# EAGLE design kul_rev0 (EAGLE 9.6.2)
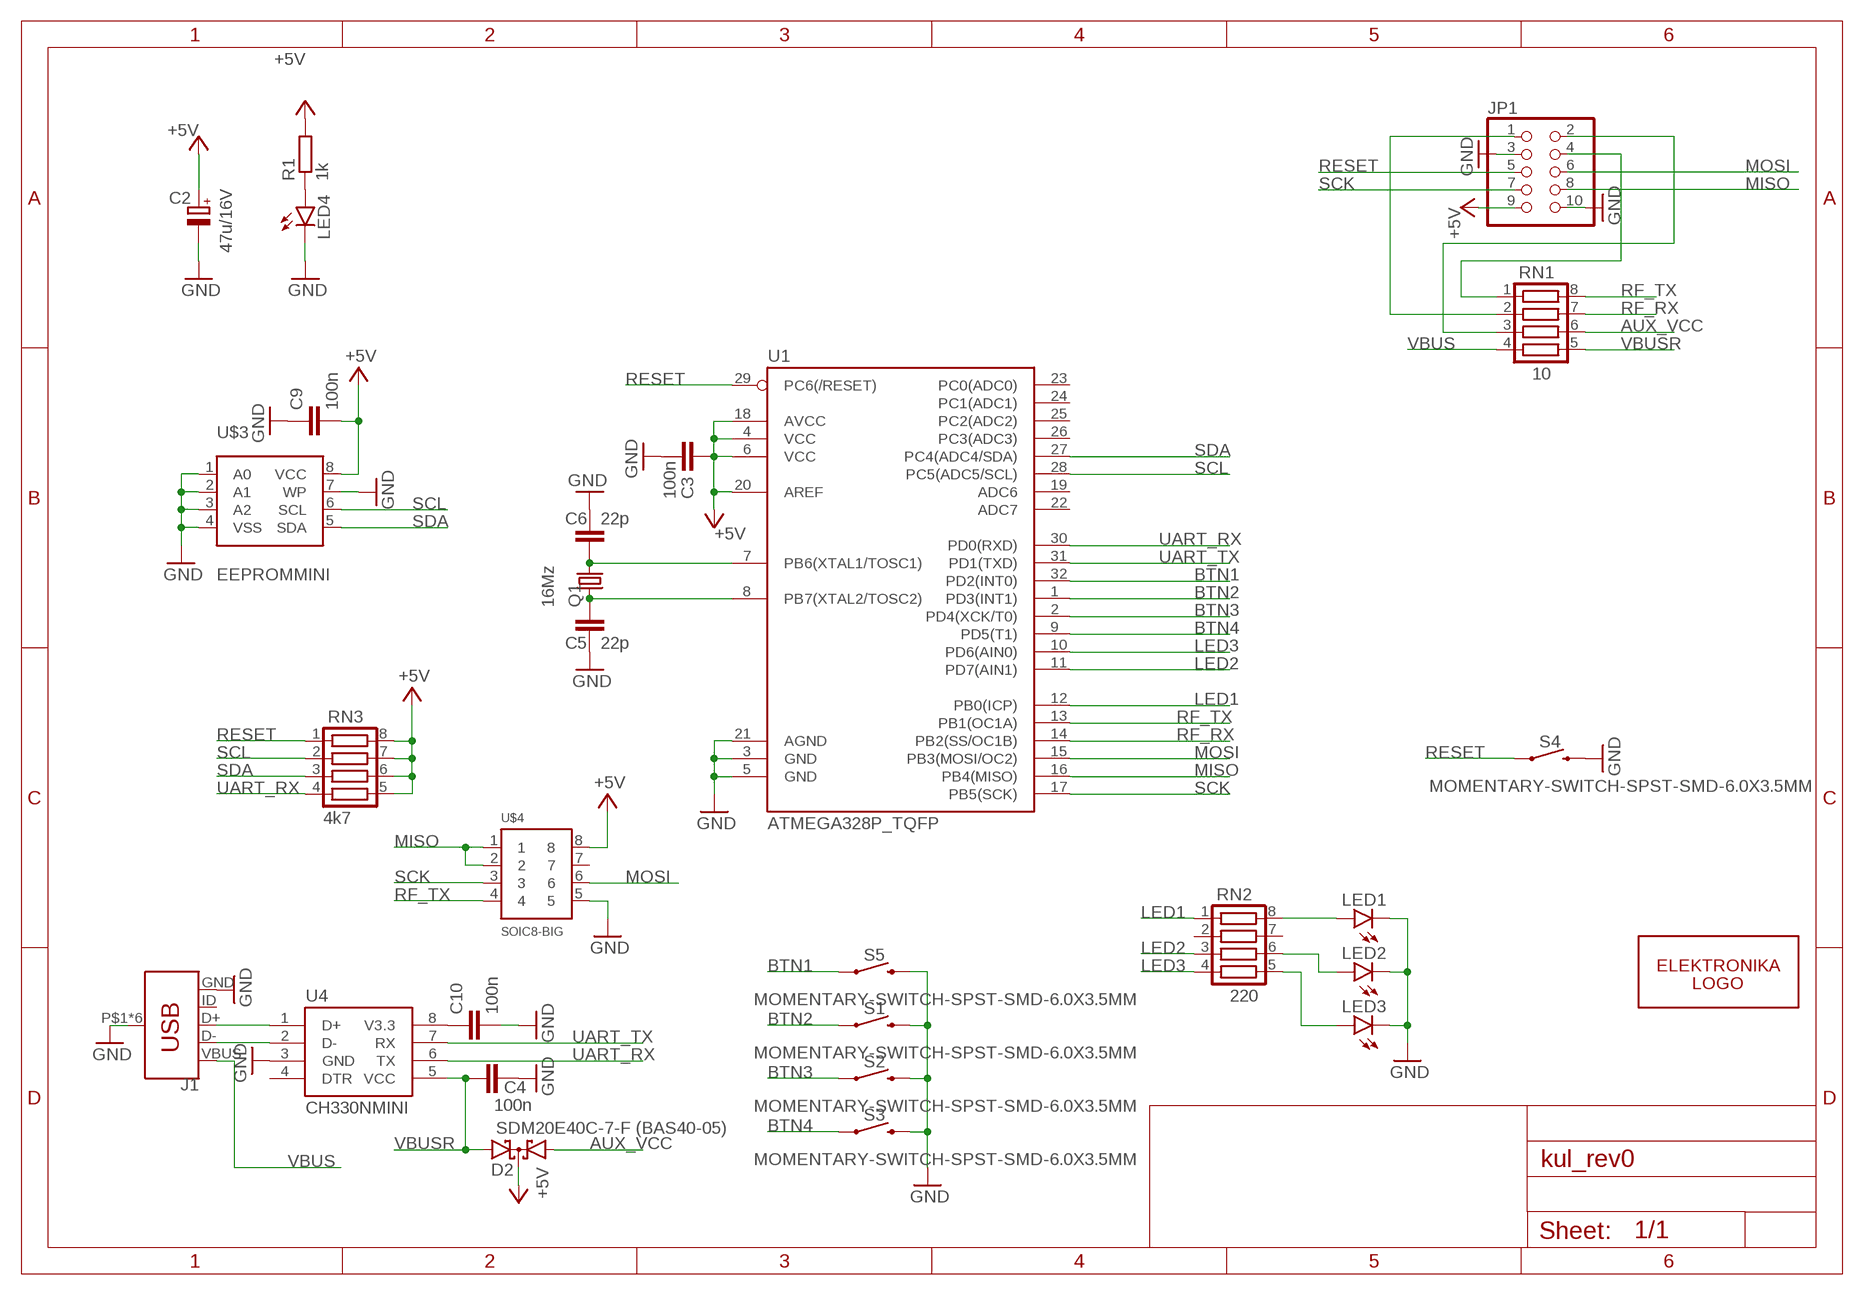
[diagram p0: schematic, sheet 1]

## Parts
C2  47u/16V  CPOL-EUCT6032  [CT6032]
C3  100n  C-EUC0603  [C0603]
C4  100n  C-EUC0603  [C0603]
C5  22p  C-EUC0603  [C0603]
C6  22p  C-EUC0603  [C0603]
C9  100n  C-EUC0603  [C0603]
C10  100n  C-EUC0603  [C0603]
D2  SDM20E40C-7-F (BAS40-05)  BAS40-05  [SOT23]
J1  USB_MICRO-BLCSC  [C40951_USB]
JP1  PINHD-2X5/90  [2X05/90]
LED1  LEDCHIP-LED0805  [CHIP-LED0805]
LED2  LEDCHIP-LED0805  [CHIP-LED0805]
LED3  LEDCHIP-LED0805  [CHIP-LED0805]
LED4  LEDCHIP-LED0805  [CHIP-LED0805]
Q1  16Mz  KX-7  [3.2X2.5_KX-7]
R1  1k  R-EU_R0603  [R0603]
RN1  10  CTS742C083  [CTS742C083]
RN2  220  CTS742C083  [CTS742C083]
RN3  4k7  CTS742C083  [CTS742C083]
S1  MOMENTARY-SWITCH-SPST-SMD-6.0X3.5MM  [TACTILE_SWITCH_SMD_6.0X3.5MM]
S2  MOMENTARY-SWITCH-SPST-SMD-6.0X3.5MM  [TACTILE_SWITCH_SMD_6.0X3.5MM]
S3  MOMENTARY-SWITCH-SPST-SMD-6.0X3.5MM  [TACTILE_SWITCH_SMD_6.0X3.5MM]
S4  MOMENTARY-SWITCH-SPST-SMD-6.0X3.5MM  [TACTILE_SWITCH_SMD_6.0X3.5MM]
S5  MOMENTARY-SWITCH-SPST-SMD-6.0X3.5MM  [TACTILE_SWITCH_SMD_6.0X3.5MM]
U1  ATMEGA328P_TQFP  [TQFP32-08]
U4  CH330NMINI  [SOIC8_MINI]
U$3  EEPROMMINI  [SOIC8_MINI]
U$4  SOIC8-BIG  [SOIC8_BIG]
U$6  ELEKTRONIKA_BA_ELEBA_LOGO  [ELEKTRONIKA_BA_ELEBALOGO_ELEBALOGO_B_122]

## Nets
+5V: C2.+ C3.2 C9.2 D2.3(C) JP1.9 R1.2 RN3.5 RN3.6 RN3.7 RN3.8 U1.4(VCC) U1.6(VCC) U1.18(AVCC) U1.20(AREF) U$3.8(VCC) U$4.8
AUX_VCC: D2.1(A1) RN1.6
BTN1: S5.1 U1.32(PD2(INT0))
BTN2: S1.1 U1.1(PD3(INT1))
BTN3: S2.1 U1.2(PD4(XCK/T0))
BTN4: S3.1 U1.9(PD5(T1))
GND: C2.- C3.1 C4.2 C5.2 C6.1 C9.1 C10.2 J1.GND J1.P$1(SHIELD) J1.P$2(SHIELD) J1.P$3(SHIELD) J1.P$4(SHIELD) J1.SHIELD1(SHIELD) J1.SHIELD2(SHIELD) JP1.3 JP1.10 LED1.C LED2.C LED3.C LED4.C S1.2 S2.2 S3.2 S4.2 S5.2 U1.3(GND) U1.5(GND) U1.21(AGND) U4.3(GND) U$3.1(A0) U$3.2(A1) U$3.3(A2) U$3.4(VSS) U$3.7(WP) U$4.5
LED1: RN2.1 U1.12(PB0(ICP))
LED2: RN2.3 U1.11(PD7(AIN1))
LED3: RN2.4 U1.10(PD6(AIN0))
MISO: JP1.8 U1.16(PB4(MISO)) U$4.1 U$4.2
MOSI: JP1.6 U1.15(PB3(MOSI/OC2)) U$4.6
N$1: JP1.2 RN1.3
N$2: JP1.4 RN1.1
N$3: LED2.A RN2.6
N$4: LED1.A RN2.8
N$5: LED4.A R1.1
N$8: J1.D+ U4.1(D+)
N$14: J1.D- U4.2(D-)
N$17: C10.1 U4.8(V3.3)
N$34: LED3.A RN2.5
N$35: JP1.1 RN1.2
OSC1: C6.2 Q1.3 U1.7(PB6(XTAL1/TOSC1))
OSC2: C5.1 Q1.1 U1.8(PB7(XTAL2/TOSC2))
RESET: JP1.5 RN3.1 S4.1 U1.29(PC6(/RESET))
RF_RX: RN1.7 U1.14(PB2(SS/OC1B))
RF_TX: RN1.8 U1.13(PB1(OC1A)) U$4.4
SCK: JP1.7 U1.17(PB5(SCK)) U$4.3
SCL: RN3.2 U1.28(PC5(ADC5/SCL)) U$3.6(SCL)
SDA: RN3.3 U1.27(PC4(ADC4/SDA)) U$3.5(SDA)
UART_RX: RN3.4 U1.30(PD0(RXD)) U4.6(TX)
UART_TX: U1.31(PD1(TXD)) U4.7(RX)
VBUS: J1.VBUS RN1.4
VBUSR: C4.1 D2.2(A2) RN1.5 U4.5(VCC)
Unconnected: J1.ID RN2.2 RN2.7 U1.19(ADC6) U1.22(ADC7) U1.23(PC0(ADC0)) U1.24(PC1(ADC1)) U1.25(PC2(ADC2)) U1.26(PC3(ADC3)) U4.4(DTR) U$4.7

## Library data of the parts
C2 = rcl:CPOL-EU: POLARIZED CAPACITOR, European symbol; SPICEPREFIX: C
C3-C6 C9 C10 = rcl:C-EU: CAPACITOR, European symbol; SPICEPREFIX: C
D2 = diode:BAS40-05: Silicon Schottky Diodes General-purpose diode for high-speed switching
J1 = trax_832:USB_MICRO-B: USB Type Micro-B Connector Male/female and PTH/SMT variants SparkFun Products: SparkFun microB USB Breakout <https://www.sparkfun.com/products/12035> SparkFun USB microB Plug Breakout <https://www.sparkfun.com/products/10031> SparkFun ESP8266 Thing <https://www.sparkfun.com/products/13231>
JP1 = pinhead:PINHD-2X5: PIN HEADER
LED1-LED4 = led:LED: LED OSRAM: - CHIPLED LG R971, LG N971, LY N971, LG Q971, LY Q971, LO R971, LY R971 LH N974, LH R974 LS Q976, LO Q976, LY Q976 LO Q996 - Hyper CHIPLED LW Q18S LB Q993, LB Q99A, LB R99A - SideLED LS A670, LO A670, LY A670, LG A670, LP A670 LB A673, LV A673, LT A673, LW A673 LH A674 LY A675 LS A676, LA A676, LO A676, LY A676, LW A676 LS A679, LY A679, LG A679 - Hyper Micro SIDELED® LS Y876, LA Y876, LO Y876, LY Y876 LT Y87S - SmartLED LW L88C, LW L88S LB L89C, LB L89S, LG L890 LS L89K, LO L89K, LY L89K LS L896, LA L896, LO L896, LY L896 - TOPLED LS T670, LO T670, LY T670, LG T670, LP T670 LSG T670, LSP T670, LSY T670, LOP T670, LYG T670 LG T671, LOG T671, LSG T671 LB T673, LV T673, LT T673, LW T673 LH T674 LS T676, LA T676, LO T676, LY T676, LB T676, LH T676, LSB T676, LW T676 LB T67C, LV T67C, LT T67C, LS T67K, LO T67K, LY T67K, LW E67C LS E67B, LA E67B, LO E67B, LY E67B, LB E67C, LV E67C, LT E67C LW T67C LS T679, LY T679, LG T679 LS T770, LO T770, LY T770, LG T770, LP T770 LB T773, LV T773, LT T773, LW T773 LH T774 LS E675, LA E675, LY E675, LS T675 LS T776, LA T776, LO T776, LY T776, LB T776 LHGB T686 LT T68C, LB T68C - Hyper Mini TOPLED® LB M676 - Mini TOPLED Santana® LG M470 LS M47K, LO M47K, LY M47K Source: http://www.osram.convergy.de LUXEON: - LUMILED® LXK2-PW12-R00, LXK2-PW12-S00, LXK2-PW14-U00, LXK2-PW14-V00 LXK2-PM12-R00, LXK2-PM12-S00, LXK2-PM14-U00 LXK2-PE12-Q00, LXK2-PE12-R00, LXK2-PE12-S00, LXK2-PE14-T00, LXK2-PE14-U00 LXK2-PB12-K00, LXK2-PB12-L00, LXK2-PB12-M00, LXK2-PB14-N00, LXK2-PB14-P00, LXK2-PB14-Q00 LXK2-PR12-L00, LXK2-PR12-M00, LXK2-PR14-Q00, LXK2-PR14-R00 LXK2-PD12-Q00, LXK2-PD12-R00, LXK2-PD12-S00 LXK2-PH12-R00, LXK2-PH12-S00 LXK2-PL12-P00, LXK2-PL12-Q00, LXK2-PL12-R00 Source: www.luxeon.com KINGBRIGHT: KA-3528ASYC Source: www.kingbright.com
Q1 = crystal-geyer_V1_0:KX: Quartz Crystals (MHz) SMD: KX - Serie Model Size l/w/h [mm] Frequency Range Frequency Stability Temp. Range [°C] Load Capacitance AECQ 200 availabel Datasheet KX-4 KX-5 KX-6 KX-7 KX-9A KX-9B KX-12A KX-12B KX-13 KX-20 KX-K KX-KS 1.6/1.2/0.3 2.0/1.6/0.45 2.5/2.0/0.55 3.2/2.5/0.8 5.0/3.2/1.0 5.0/3.2/1.1 6.0/3.5/1.1 6.0/3.5/1.0 7.0/5.0 /1.3 11.6/5.5/1.6 12.3/4.5/4.2 12.3/4.5/3.2 24.0 ~ 80.0 MHz 16.0 ~ 80.0 MHz 12.0 ~ 80.0 MHz 8.0 ~ 60.0 MHz 7,68 ~ 300,0 MHz 8,0 ~ 50,0 MHz 8,0 ~ 150,0 MHz 8,0 ~ 50,0 MHz 6,0 ~ 160,0 MHz 3,579 ~ 25,0 MHz 3,579 ~ 70,0 MHz 3,579 ~ 70,0 MHz ±10 … ±50ppm ±10 … ±50ppm ±10 … ±50ppm ±10 … ±50ppm ±10 … ±50ppm ±10 … ±50ppm ±10 … ±50ppm ±10 … ±50ppm ±10 … ±50ppm ±50ppm ±10 … ±50ppm ±10 … ±50ppm (*) -40°C …+85°C (*) -40°C …+125°C (*) -40°C …+125°C (*) -40°C …+125°C (*) -40°C …+105°C (*) -40°C …+105°C (*) -40°C …+125°C (*) -40°C …+105°C (*) -40°C …+105°C (*) -40°C …+105°C (*) -40°C …+85°C (*) -40°C …+85°C 8, 8…16 8, 8…16 10, 8…16 12, 7…20 16, 10…20 16, 10…20 16, 10…20 16, 12…20 16, 12…20 16, 12…20 16, 12…30 16, 12…30 - yes yes yes - - - - - - - - KX-4.pdf <http://www.geyer-electronic.de/uploads/tx_userartikelfrequenz/GEYER-KX-4.pdf> KX-5.pdf <http://www.geyer-electronic.de/uploads/tx_userartikelfrequenz/GEYER-KX-5.pdf> KX-6.pdf <http://www.geyer-electronic.de/uploads/tx_userartikelfrequenz/GEYER-KX-6.pdf> KX-7.pdf <http://www.geyer-electronic.de/uploads/tx_userartikelfrequenz/GEYER-KX-7.pdf> KX-9A.pdf <http://www.geyer-electronic.de/uploads/tx_userartikelfrequenz/GEYER-KX-9A.pdf> KX-9B.pdf <http://www.geyer-electronic.de/uploads/tx_userartikelfrequenz/GEYER-KX-9B.pdf> KX-12A.pdf <http://www.geyer-electronic.de/uploads/tx_userartikelfrequenz/GEYER-KX-12A.pdf> KX-12B.pdf <http://www.geyer-electronic.de/uploads/tx_userartikelfrequenz/GEYER-KX-12B.pdf> KX-13.pdf <http://www.geyer-electronic.de/uploads/tx_userartikelfrequenz/GEYER-KX-13.pdf> KX-20.pdf <http://www.geyer-electronic.de/uploads/tx_userartikelfrequenz/GEYER-KX-20.pdf> KX-K.pdf <http://www.geyer-electronic.de/uploads/tx_userartikelfrequenz/GEYER-KX-K.pdf> KX-KS.pdf <http://www.geyer-electronic.de/uploads/tx_userartikelfrequenz/GEYER-KX-KS.pdf> <http://www.geyer-electronic.de/fileadmin/template/img/logo-geyer-electronic.png> Details see: http://www.geyer-electronic.de/Frequenz-Produkte.9.0.html Created 2016-06-07, Hans Locher 2016 (C) Geyer Quartz Technology KX4,KX5,KX6,KX7,KX9A,KX9B,KX12A,KX12B,KX13,KX20,KXK,KXKS;1612;2016;2520;3225;5032;6035;7050;11655;12345;1,6x1,2;2,0x1,6;2,5x2,0;3,2x2,5;5,0x3,2;6,0x3,5;7,0x5,0;11,6x5,5;12,3x4,5;12,3x4,5;1.6x1.2;2.0x1.6;2.5x2.0;3.2x2.5;5.0x3.2;6.0x3.5;7.0x5.0;11.6x5.5;12.3x4.5;12.3x4.5;
R1 = rcl:R-EU_: RESISTOR, European symbol; SPICEPREFIX: R
RN1-RN3 = resistor-net:CTS742C083: Chip Resistor Array 4 Single Resistor Source: http://www.ctscorp.com/components/Datasheets/CTSChipArrayDs.pdf; OC_FARNELL: unknown; OC_NEWARK: unknown
S1-S5 = SparkFun-Switches:MOMENTARY-SWITCH-SPST: Momentary Switch (Pushbutton) - SPST Normally-open (NO) SPST momentary switches (buttons, pushbuttons). Variants PTH-12MM - 12mm square, through-hole Momentary Pushbutton Switch - 12mm Square <https://www.sparkfun.com/products/9190> (COM-09190) PTH-6.0MM, PTH-6.0MM-KIT - 6.0mm square, through-hole Mini Pushbutton Switch <https://www.sparkfun.com/products/97> (COM-00097) KIT package intended for soldering kit's - only one side of pads' copper is exposed. PTH-RIGHT-ANGLE-KIT - Right-angle, through-hole Right Angle Tactile Button <https://www.sparkfun.com/products/10791> - Used on SparkFun BigTime Watch Kit <https://www.sparkfun.com/products/11734> SMD-12MM - 12mm square, surface-mount Tactile Button - SMD (12mm) <https://www.sparkfun.com/products/12993> (COM-12993) Used on SparkFun PicoBoard <https://www.sparkfun.com/products/11888> SMD-4.5MM - 4.5mm Square Trackball Switch Used on SparkFun Blackberry Trackballer Breakout <https://www.sparkfun.com/products/13169> SMD-4.6MMX2.8MM - 4.60mm x 2.80mm, surface mount Used on SparkFun SAMD21 Mini Breakout <https://www.sparkfun.com/products/13664> SMD-5.2MM, SMD-5.2-REDUNDANT - 5.2mm square, surface-mount Mini Pushbutton Switch - SMD <https://www.sparkfun.com/products/8720> (COM-08720) Used on Arduino Pro Mini <https://www.sparkfun.com/products/11114> REDUNDANT package connects both switch circuits together SMD-6.0X3.5MM - 6.0 x 3.5mm, surface mount Momentary Reset Switch SMD <https://www.sparkfun.com/products/8229> (COM-08229) SMD-6.2MM-TALL - 6.2mm square, surface mount Tactile Button - SMD (6mm) <https://www.sparkfun.com/products/12992> Used on SparkFun Digital Sandbox <https://www.sparkfun.com/products/12651> SMD-RIGHT-ANGLE - Right-angle, surface mount Used on SparkFun Block for Intel® Edison - Arduino <https://www.sparkfun.com/products/13036>; PROD_ID: SWCH-00815; SF_SKU: COM-08229
U1 = SparkFun-IC-Microcontroller:ATMEGA328P_TQFP: Popular 328P in QFP Storefront component: ATmega328 - TQFP <https://www.sparkfun.com/products/13448> (COM-13448) Datasheet <http://www.sparkfun.com/datasheets/Components/SMD/ATMega328.pdf> SparkFun Products SparkFun RedBoard - Programmed with Arduino <https://www.sparkfun.com/products/12757> (DEV-12757) Arduino Pro Mini 328 - 5V/16MHz <https://www.sparkfun.com/products/11113> (DEV-11113) Arduino Pro Mini 328 - 3.3V/8MHz <https://www.sparkfun.com/products/11114> (DEV-11114) SparkFun OpenLog <https://www.sparkfun.com/products/13712> (DEV-13712) SparkFun MicroView - OLED Arduino Module <https://www.sparkfun.com/products/12923> (DEV-12923) SparkFun Digital Sandbox <https://www.sparkfun.com/products/12651> (DEV-12651) SparkFun PicoBoard <https://www.sparkfun.com/products/11888> (WIG-11888) Arduino Fio <https://www.sparkfun.com/products/10116> (DEV-10116) LilyPad Arduino 328 Main Board <https://www.sparkfun.com/products/13342> (DEV-13342) SparkFun RedStick <https://www.sparkfun.com/products/13741> (DEV-13741) LilyPad MP3 <https://www.sparkfun.com/products/11013> (DEV-11013) LilyPad Arduino SimpleSnap <https://www.sparkfun.com/products/10941> (DEV-10941) SparkFun Stepoko <https://www.sparkfun.com/products/13899> (ROB-13899) SparkFun Geiger Counter <https://www.sparkfun.com/products/11345> (SEN-11345) SparkFun EL Sequencer <https://www.sparkfun.com/products/12781> (COM-12781) Arduino Pro 328 - 5V/16MHz <https://www.sparkfun.com/products/10915> (DEV-10915) CryptoCape <https://www.sparkfun.com/products/12773> (DEV-12773) SparkFun IR Thermometer Evaluation Board - MLX90614 <https://www.sparkfun.com/products/10740> (SEN-10740) SparkFun RedBot Mainboard <https://www.sparkfun.com/products/12097> (ROB-12097) Arduino Pro 328 - 3.3V/8MHz <https://www.sparkfun.com/products/10914> (DEV-10914) SparkFun Block for Intel® Edison - Arduino <https://www.sparkfun.com/products/13036> (DEV-13036) SparkFun Simon Says - Surface Mount Soldering Kit <https://www.sparkfun.com/products/10935> (KIT-10935) SparkFun 7-Segment Serial Display - Red <https://www.sparkfun.com/products/11441> (COM-11441) SparkFun 7-Segment Serial Display - White <https://www.sparkfun.com/products/11629> (COM-11629) SparkFun 7-Segment Serial Display - Yellow <https://www.sparkfun.com/products/11443> (COM-11443) SparkFun 7-Segment Serial Display - Kelly Green <https://www.sparkfun.com/products/11440> (COM-11440) SparkFun 7-Segment Serial Display - Blue <https://www.sparkfun.com/products/11442> (COM-11442) SparkFun OpenSegment Serial Display - 20mm (Blue) <https://www.sparkfun.com/products/11647> (COM-11647) SparkFun OpenSegment Serial Display - 20mm (Green) <https://www.sparkfun.com/products/11646> (COM-11646) SparkFun OpenSegment Serial Display - 20mm (White) <https://www.sparkfun.com/products/11648> (COM-11648) SparkFun OpenSegment Serial Display - 20mm (Red) <https://www.sparkfun.com/products/11644> (COM-11644) SparkFun OpenSegment Serial Display - 20mm (Yellow) <https://www.sparkfun.com/products/11645> (COM-11645) SparkFun OpenSegment Shield <https://www.sparkfun.com/products/13190> (DEV-13190); PROD_ID: IC-09069
U4 = trax_832:CH330N
U$3 = trax_832:EEPROM
U$4 = trax_832:SOIC8-BIG
U$6 = elebalogo:ELEKTRONIKA_BA_ELEBA_LOGO

## Board
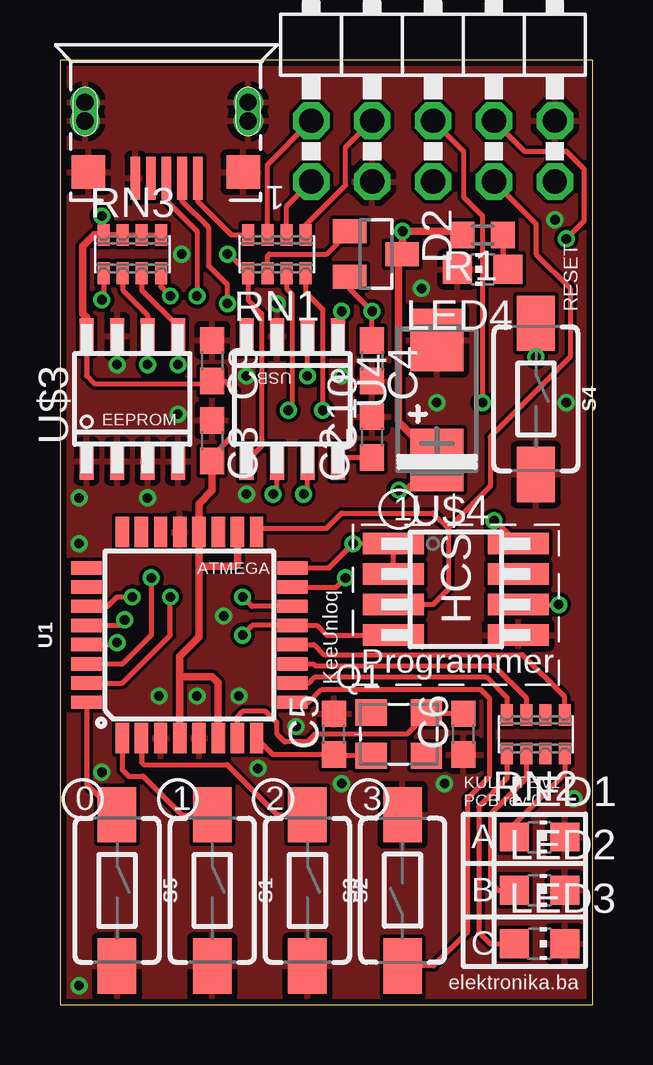
[diagram p1: board, top side]
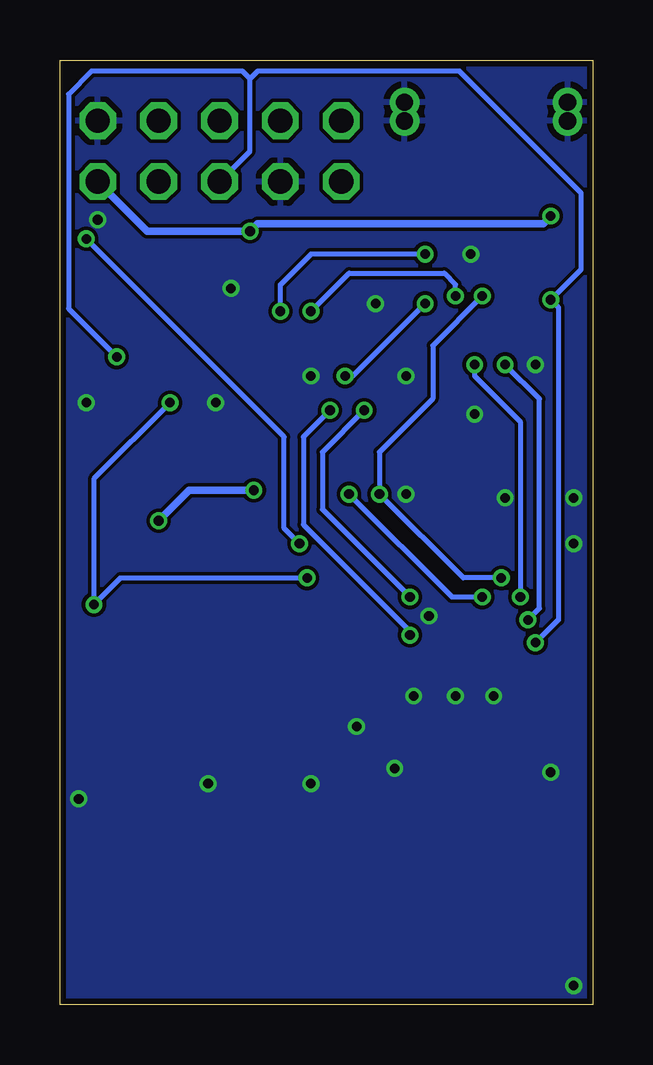
[diagram p2: board, bottom side, seen from below]

Size 22.21 x 39.36 mm. Coordinates in mm from the lower left corner, seen from the top.
Outline: 0,0 22.21,0 22.21,39.36 0,39.36 0,0
Copper layers (1*16): Top 0.035mm / dielectric 1.5mm / Bottom 0.035mm
Design rules "Fusion_eagle_rule_v1.1": minimum track width 6mil, minimum drill 12mil, track to track 6mil, track to pad 6mil, pad to pad 6mil, via to via 6mil, smd to smd 0mil, copper to edge 10mil, drill to drill 10mil, minimum pad ring 10mil, minimum via ring 6mil, stop-mask expansion 2mil, vias tented up to drill 100mil, thermal gap 10mil

### Footprints (pad centres in the part's own frame; a part is rotated, then mirrored left to right if it is on the bottom)
CT6032 = smd 2.6 x 2.2: + -2.5,0; - 2.5,0
C0603 = smd 1.1 x 1: 1 -0.85,0; 2 0.85,0
SOT23 = smd 1 x 1.4: 1 -0.95,-1.1; 2 0.95,-1.1; 3 0,1.1
C40951_USB = smd 1.8 x 0.4: D+ -2.55,0; D- -2.55,-0.65; GND -2.55,1.3; ID -2.55,0.65; VBUS -2.55,-1.3 | drill 0.72 pad 1.2: P$1 -0.17,3.4; P$2 0.61,3.4; P$3 -0.17,-3.4; P$4 0.61,-3.4 | smd 1.4 x 1.4: SHIELD1 -2.3,3.25; SHIELD2 -2.3,-3.2
2X05/90 = drill 1.016 octagon: 1 -5.08,-6.35; 2 -5.08,-3.81; 3 -2.54,-6.35; 4 -2.54,-3.81; 5 0,-6.35; 6 0,-3.81; 7 2.54,-6.35; 8 2.54,-3.81; 9 5.08,-6.35; 10 5.08,-3.81
CHIP-LED0805 = smd 1.2 x 1.2: A 0,-1.05; C 0,1.05
3.2X2.5_KX-7 = smd 1.3 x 1.1: 1 -1.15,-0.9; 2 1.15,-0.9; 3 1.15,0.9; 4 -1.15,0.9
R0603 = smd 1 x 1.1: 1 -0.85,0; 2 0.85,0
CTS742C083 = smd 0.5 x 0.9: 1 -1.2,-0.8; 2 -0.4,-0.8; 3 0.4,-0.8; 4 1.2,-0.8; 5 1.2,0.8; 6 0.4,0.8; 7 -0.4,0.8; 8 -1.2,0.8
TACTILE_SWITCH_SMD_6.0X3.5MM = smd 2.3 x 1.6: 1 -3.15,0; 2 3.15,0
TQFP32-08 = smd 1.27 x 0.559: 1 -4.293,2.8; 2 -4.293,2; 3 -4.293,1.2; 4 -4.293,0.4; 5 -4.293,-0.4; 6 -4.293,-1.2; 7 -4.293,-2; 8 -4.293,-2.8; 17 4.293,-2.8; 18 4.293,-2; 19 4.293,-1.2; 20 4.293,-0.4; 21 4.293,0.4; 22 4.293,1.2; 23 4.293,2; 24 4.293,2.8 | smd 0.559 x 1.27: 9 -2.8,-4.293; 10 -2,-4.293; 11 -1.2,-4.293; 12 -0.4,-4.293; 13 0.4,-4.293; 14 1.2,-4.293; 15 2,-4.293; 16 2.8,-4.293; 25 2.8,4.293; 26 2,4.293; 27 1.2,4.293; 28 0.4,4.293; 29 -0.4,4.293; 30 -1.2,4.293; 31 -2,4.293; 32 -2.8,4.293
SOIC8_MINI = smd 0.584 x 1.524: 1 -1.905,-2.6; 2 -0.635,-2.6; 3 0.635,-2.6; 4 1.905,-2.6; 5 1.905,2.6; 6 0.635,2.6; 7 -0.635,2.6; 8 -1.905,2.6
SOIC8_BIG = smd 0.889 x 2.54: 1 -1.905,-2.6; 2 -0.635,-2.6; 3 0.635,-2.6; 4 1.905,-2.6; 5 1.905,2.6; 6 0.635,2.6; 7 -0.635,2.6; 8 -1.905,2.6

### Placement (x,y rotation side)
C2  15.72,25.19 90 top
C3  6.35,23.5 270 top
C4  13.02,26.83 270 top
C5  11.43,11.27 90 top
C6  16.83,11.27 90 top
C9  6.35,26.83 270 top
C10  13.02,23.65 90 top
D2  13.18,31.27 270 top
J1  4.45,36.99 90 top
JP1  15.56,40.64 0 top
LED1  20,6.99 270 top
LED2  20,4.76 270 top
LED3  20,2.54 270 top
LED4  17.62,30.64 90 top
Q1  14.13,11.27 0 top
R1  17.62,32.07 180 top
RN1  9.05,31.27 180 top
RN2  19.84,11.27 180 top
RN3  3.02,31.27 0 top
S1  6.35,4.76 270 top
S2  10.32,4.76 270 top
S3  14.29,4.76 90 top
S4  19.84,25.24 270 top
S5  2.38,4.76 270 top
U1  5.4,15.4 90 top
U4  9.68,25.24 180 top
U$3  3.02,25.24 0 top
U$4  16.51,17.3 270 top
U$6  13.97,9.21 0 bottom

### Tracks (layer width: path | path; a pad name or v marks a point on that pad's centre or on a via)
+5V  (via drill 0.4)
  Top 0.203: U$3.8 1.11,26.19 1.43,25.88 6.25,25.88 C9.2 6.88,25.98 7.3,25.56 7.3,23.81 6.35,22.86 C3.2 | RN3.5 RN3.6 RN3.7 RN3.8 1.82,32.79 v1.75,32.86 | v14.29,32.23 14.28,32.22 | 15.4,23.01 15.4,23 | U$4.8 18.16,20.16 v18.1,20.16
  Top 0.305: 5.8,18.26 U1.20 5.8,20.88 6.35,21.43 C3.2 | 5.8,18.26 5.8,15.32 5,14.52 5,13.65 | 5,13.65 U1.4 | U1.18 7.4,18.35 7.3,18.26 5.8,18.26 | U1.6 6.6,13.4 6.35,13.65 5,13.65 | U$3.8 1.11,28.64 0.95,28.79 0.95,31.59 1.44,32.07 RN3.8 | 14.28,32.22 D2.3 14.12,31.11 14.12,24.29 15.4,23.01 | 15.4,23 C2.+ 14.46,21.43 v14.13,21.43 | v14.29,32.23 16.61,32.23 R1.2
  Bottom 0.305: v1.75,32.86 2.06,32.54 13.97,32.54 v14.29,32.23 18.57,32.23 JP1.9 | v14.13,21.43 16.83,21.43 v18.1,20.16
AUX_VCC
  Top 0.203: RN1.6 8.65,31.19 8.73,31.27 11.13,31.27 D2.1
BTN1
  Top 0.203: U1.32 1.1,9.19 S5.1
BTN2
  Top 0.203: U1.1 2.6,9.79 2.86,9.53 3.47,9.53 5.08,7.91 S1.1
BTN3
  Top 0.203: U1.2 3.4,10.1 3.49,10 6.96,10 9.05,7.91 S2.1
BTN4
  Top 0.203: S3.1 15.58,1.61 16.99,3.02 16.99,8.57 17.9,9.48 17.9,12.78 17.54,13.13 10.91,13.13 10.38,12.6 U1.9
GND  (via drill 0.4)
  other vias: 0.79,0.79 4.13,12.86 7.46,12.86 2.38,26.67 15.72,25.08 21.11,25.08 7.78,21.27 0.79,21.11 5.08,31.27 5.71,12.86 21.43,8.57 4.92,24.61 7.78,26.19 9.05,29.21 9.84,11.59 11.75,26.19 3.65,21.11 0.79,19.21 20.64,32.7 16.03,9.21 8.26,9.84 11.75,9.21 15.08,29.84 1.75,9.68 6.83,16.19
  pour Bottom: -0.32,39.69 22.7,39.69 22.7,-0.32 -0.32,-0.32
  pour Top: -0.32,39.69 22.7,39.69 22.7,-0.32 -0.32,-0.32
LED1
  Top 0.203: U1.12 10.59,15 11,14.59 19.28,14.59 21.04,12.82 RN2.1
LED2
  Top 0.203: U1.11 10.57,14.2 10.64,14.13 18.1,14.13 19.44,12.78 RN2.3
LED3
  Top 0.203: RN2.4 18.64,12.79 17.78,13.65 10.64,13.65 10.38,13.4 U1.10
MISO  (via drill 0.4)
  Top 0.203: U$4.2 U$4.1 v12.22,19.21 11.21,18.2 U1.16 | JP1.8 19.37,35.56 21.11,35.56 21.86,34.82 21.86,32.65 v21.11,31.91
  Bottom 0.203: v12.22,19.21 12.86,19.84 12.86,23.65 v21.11,31.91
MOSI  (via drill 0.4)
  Top 0.203: U$4.6 v20.8,16.67 | JP1.6 16.83,35.56 16.83,33.66 17.62,32.86 v17.62,25.08 | U1.15 11.53,17.4 v11.91,17.78
  Bottom 0.203: v11.91,17.78 19.68,17.78 v20.8,16.67 20.8,21.91 v17.62,25.08
N$1
  Top 0.203: RN1.3 8.65,35 JP1.2
N$2
  Top 0.203: RN1.1 10.25,32.47 11.91,34.13 11.91,35.72 JP1.4
N$3
  Top 0.203: RN2.6 19.44,9.44 17.94,7.94 17.94,5.08 18.26,4.76 LED2.A
N$4
  Top 0.203: RN2.8 21.04,9.61 18.95,7.52 LED1.A
N$5
  Top 0.203: R1.1 18.47,30.84 LED4.A
N$8  (via drill 0.4)
  Top 0.203: J1.D+ 4.45,33.5 5.71,32.23 v5.71,29.53 | U4.1 11.59,28.73 v11.75,28.89
  Bottom 0.203: v11.75,28.89 10.16,30.48 6.19,30.48 5.71,30 v5.71,29.53
N$14  (via drill 0.4)
  Top 0.203: v10.32,26.19 U4.2 | J1.D- 5.08,34.42 5.08,33.5 6.19,32.38 6.19,30.8 6.99,30 v6.99,29.21
  Bottom 0.203: v10.32,26.19 10,26.19 v6.99,29.21
N$17
  Top 0.203: U4.8 11.75,22.8 C10.1
N$34
  Top 0.203: RN2.5 18.64,9.44 17.46,8.26 17.46,3.02 17.94,2.54 LED3.A
N$35
  Top 0.203: RN1.2 9.45,33.26 JP1.1
OSC1
  Top 0.203: C6.2 15.33,12.12 | 15.33,12.12 Q1.3 | U1.7 7.4,12 7.62,12.22 8.57,12.22 9.05,11.75 9.05,11.27 9.37,10.95 10.32,10.95 10.64,11.27 14.48,11.27 15.33,12.12
OSC2
  Top 0.203: Q1.1 11.48,10.37 C5.1 8.88,10.42 U1.8
RESET  (via drill 0.4)
  Top 0.203: RN3.1 1.82,29.44 v1.75,29.37 | S4.1 v19.84,26.99 | U1.29 2.3,15 v2.38,15.08
  Bottom 0.203: 14.29,38.58 14.29,35.56 JP1.5 | v19.84,26.99 21.86,29 21.86,37.94 20.9,38.89 14.61,38.89 14.29,38.58 | v2.38,15.08 1.43,16.03 1.43,29.05 v1.75,29.37 0.48,30.64 0.48,33.81 5.56,38.89 13.97,38.89 14.29,38.58
RF_RX  (via drill 0.4)
  Top 0.203: RN1.7 9.45,29.84 9.68,29.6 9.68,24.92 v9.53,24.77 | U1.14 8.01,16.6 v7.62,16.99
  Bottom 0.203: v9.53,24.77 11.27,23.02 11.27,20.64 v7.62,16.99
RF_TX  (via drill 0.4)
  Top 0.203: U$4.4 11.11,15.4 10.71,15.8 U1.13 8.02,15.8 v7.62,15.4 | RN1.8 10.25,29.68 10.95,28.98 v10.95,24.77
  Bottom 0.203: v10.95,24.77 12.06,23.65 12.06,20 7.62,15.56 v7.62,15.4
SCK
  Top 0.203: JP1.7 19.84,32.54 19.84,31.27 21.27,29.84 21.27,26.99 17.94,23.65 17.94,21.59 16.19,19.84 | U1.17 8.35,19.84 11.11,19.84 11.75,20.48 15.56,20.48 16.19,19.84 | 16.19,19.84 16.19,17.3 15.56,16.67 U$4.3
SCL  (via drill 0.4)
  Top 0.203: v3.65,26.67 U$3.6 3.65,28.73 2.62,29.77 RN3.2 | U1.28 2.46,15.8 v2.7,16.03
  Bottom 0.203: v2.7,16.03 2.22,16.51 2.22,25.24 v3.65,26.67
SDA  (via drill 0.4)
  Top 0.203: v4.92,26.67 U$3.5 4.92,28.26 3.42,29.76 RN3.3 | U1.27 1.99,16.6 2.38,16.99 v3.02,16.99
  Bottom 0.203: v3.02,16.99 3.02,24.29 4.92,26.19 v4.92,26.67
UART_RX  (via drill 0.4)
  Top 0.203: U1.30 2.61,14.2 3.81,15.4 v3.81,17.78 | RN3.4 4.22,29.91 v4.6,29.53 | v8.89,21.27 9.05,21.43 U4.6
  Bottom 0.203: v3.81,17.78 5.4,17.78 v8.89,21.27 8.89,23.02 6.67,25.24 6.67,27.46 v4.6,29.53
UART_TX  (via drill 0.4)
  Top 0.203: U1.31 2.6,13.4 4.6,15.4 v4.6,16.99 | v10.16,21.27 10.32,21.43 U4.7
  Bottom 0.203: v4.6,16.99 5.87,16.99 v10.16,21.27
VBUS
  Top 0.203: J1.VBUS 5.75,33.47 7.14,32.07 RN1.4
VBUSR  (via drill 0.4)
  Top 0.203: v6.99,31.27 7.05,31.27 RN1.5 7.85,29.36 8.41,28.8 8.41,23.28 U4.5 | C4.1 v13.02,28.89 12.08,29.83 D2.2
  Bottom 0.203: v6.99,31.27 11.75,31.27 13.02,30 v13.02,28.89

### Text on the board
_tsilk: 1 | RESET | USB | EEPROM | 1 | ATMEGA | HCS | Programmer | KeeUnloq | 0 | 1 | 2 | 3 | KUL LITE v1 / PCB rev 0 | A | B | C | elektronika.ba
_bsilk: INTERFACE + ISP | www.elektronika.ba